# EasyEDA schematic src.json
TITLE: Sheet_1; REV: 1.0; Date: 2025-04-05; Sheet: 1/1; Drawn By: codesaksham; Company: Your Company
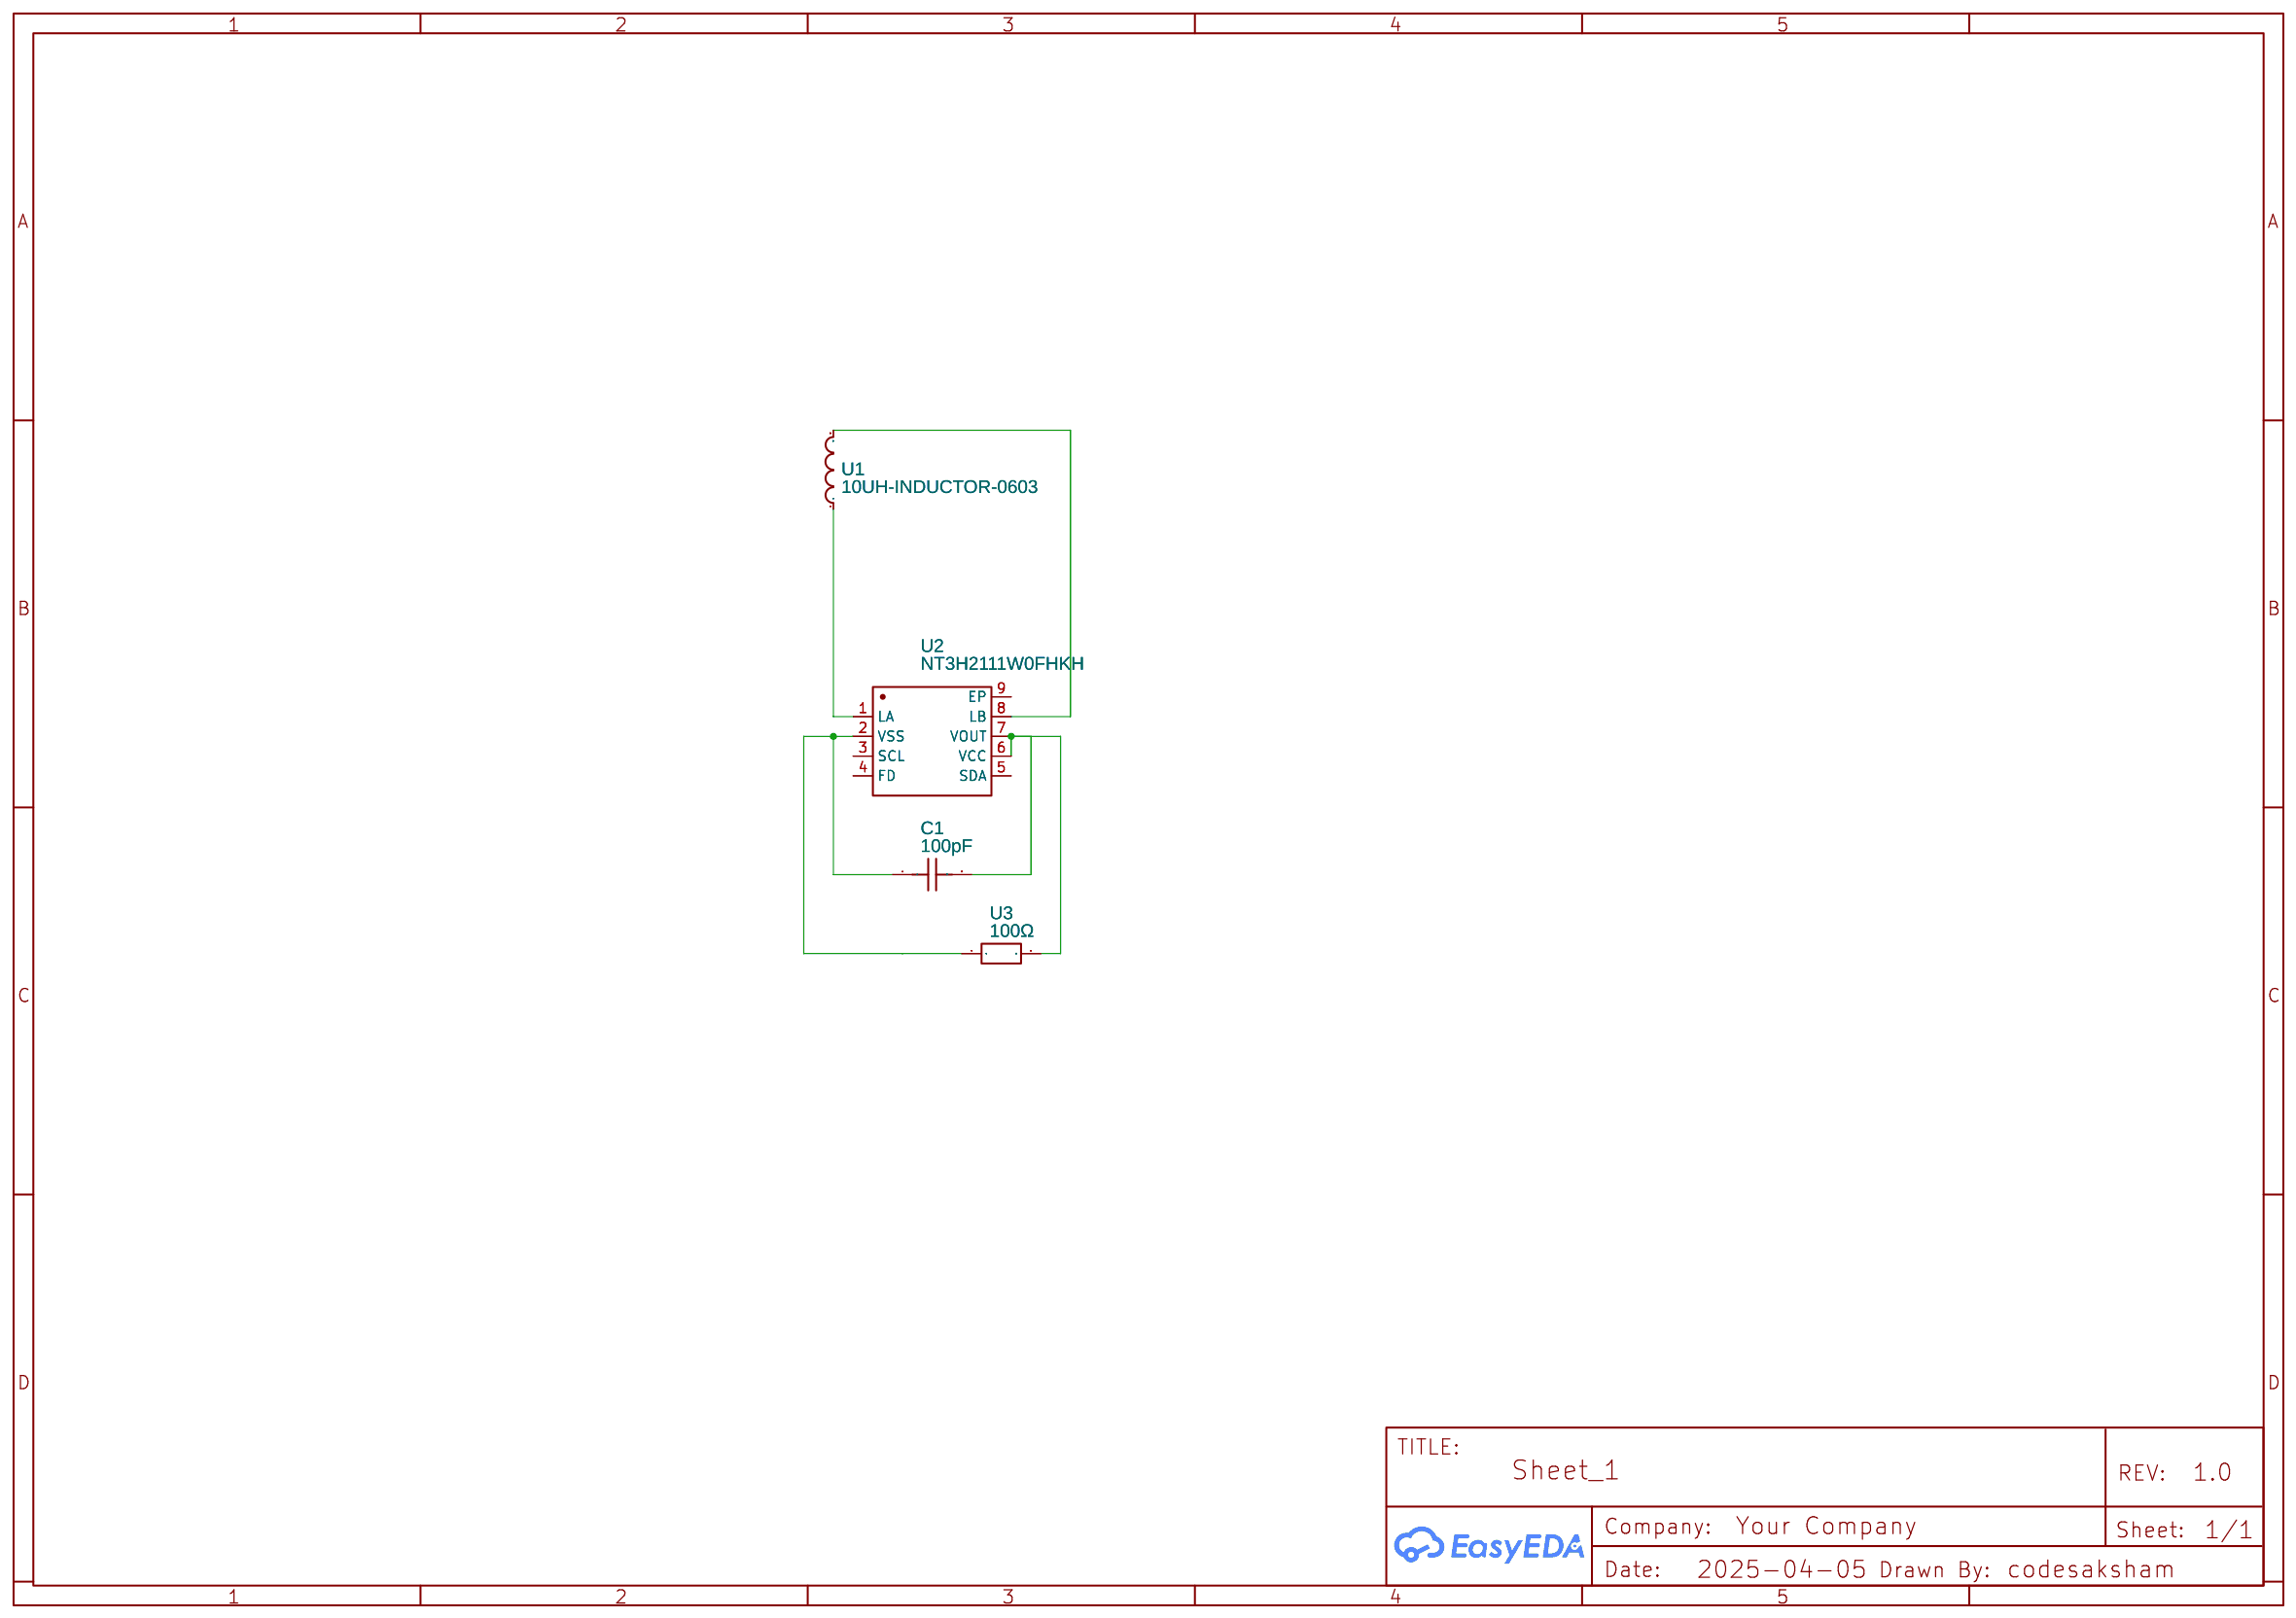
[diagram p0: schematic sheet]

## Parts
C1  100pF  [C01005]
U1  10UH-INDUCTOR-0603  [IND-SMD_L1.6-W1.0]
U2  NT3H2111W0FHKH  [XQFN-8_L1.6-W1.6-P0.50-BL]
U3  100Ω  [R1005]

## Library data of the parts
C1 = C0402X6S1A101K020BC: Contributor: lcsc; Supplier: LCSC; Supplier Part: C3876469; Manufacturer: TDK; JLCPCB Part Class: Extended Part
U1 = 10UH-INDUCTOR-0603: Contributor: lcsc; Supplier: LCSC; Supplier Part: C9900016650; Manufacturer: null; Manufacturer Part: 10uH-INDUCTOR-0603; JLCPCB Part Class: Extended Part
U2 = NT3H2111W0FHKH: Contributor: LCSC; Supplier: LCSC; Supplier Part: C710403; Manufacturer: NXP(恩智浦); JLCPCB Part Class: Extended Part
U3 = M55342H03B100DRT5: Supplier: LCSC; Supplier Part: C4134929; Manufacturer: VISHAY(威世); JLCPCB Part Class: Extended Part; Contributor: lcsc

## Nets
Net-(C1-1): C1.1 U2.2(VSS) U3.1
Net-(C1-2): C1.2 U2.6(VCC) U2.7(VOUT) U3.2
Net-(U1-1): U1.1 U2.1(LA)
Net-(U1-2): U1.2 U2.8(LB)

Not connected (* = marked no-connect by the designer): U2 3(SCL) 4(FD) 5(SDA) 9(EP)
